# Altium schematic sheet ESPSmartPlug.SchDoc
size A
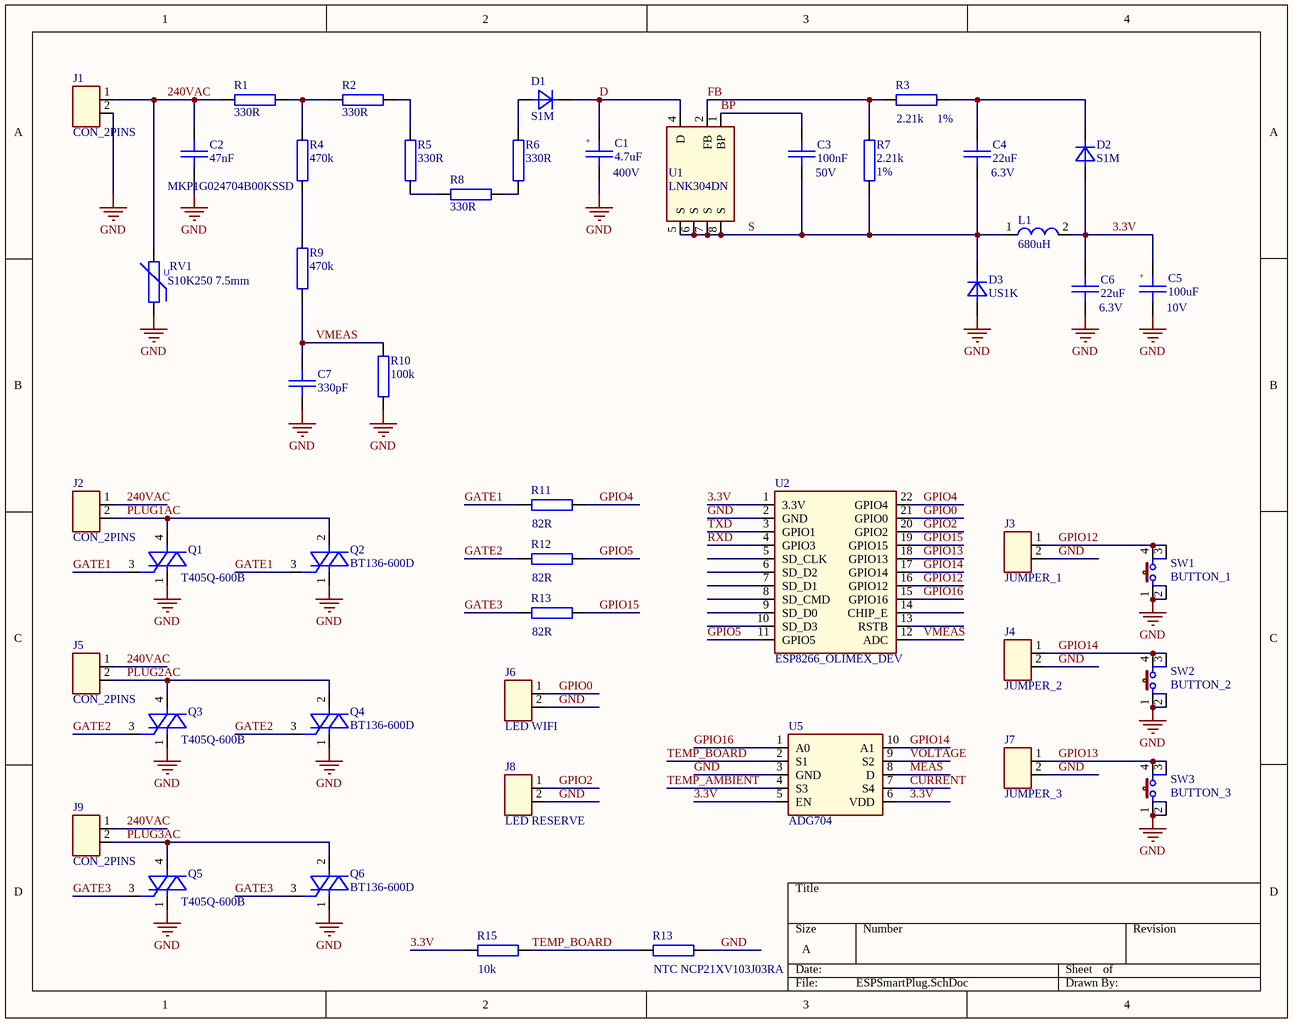
[diagram p0: ESPSmartPlug.SchDoc]

## Parts
(Parts that share a designator on the sheet are numbered #1, #2 ... from top to bottom, then left to right.)
C1  4.7uF  VOLTAGE: 400V  [SMD_CAPAE1030X1050N]
C2  47nF  MANUFACTURER_NUMBER: MKP1G024704B00KSSD  [PTH_CAPA1500-630X1850X1550]
C3  100nF  VOLTAGE: 50V  [SMD_0603_CAPC1608X95N]
C4  22uF  VOLTAGE: 6.3V  [SMD_0805_CAPC2012X95N]
C5  100uF  VOLTAGE: 10V  [SMD_CAPAE660X550N]
C6  22uF  VOLTAGE: 6.3V  [SMD_0805_CAPC2012X95N]
C7  330pF  [SMD_0603_CAPC1608X95N]
D1  S1M  [SMD_DO214AC_SMA]
D2  S1M  [SMD_DO214AC_SMA]
D3  US1K  [SMD_DO214AC_SMA]
J1  CON_2PINS  [PTH_HDRV02W11060P500_1X02]
J2  CON_2PINS  [PTH_HDRV02W11060P500_1X02]
J3  JUMPER_1  [PTH_HDRV02W64P254_1X02]
J4  JUMPER_2  [PTH_HDRV02W64P254_1X02]
J5  CON_2PINS  [PTH_HDRV02W11060P500_1X02]
J6  LED WIFI  [PTH_LED-KINGBRIGHT-L-934SGC]
J7  JUMPER_3  [PTH_HDRV02W64P254_1X02]
J8  LED RESERVE  [PTH_LED-KINGBRIGHT-L-934SGC]
J9  CON_2PINS  [PTH_HDRV02W11060P500_1X02]
L1  680uH  [SMT_INDM135130X800N]
Q1  T405Q-600B  [SMD_TO229P991X239-4N_DPAK]
Q2  BT136-600D  [PTH_TO220AB]
Q3  T405Q-600B  [SMD_TO229P991X239-4N_DPAK]
Q4  BT136-600D  [PTH_TO220AB]
Q5  T405Q-600B  [SMD_TO229P991X239-4N_DPAK]
Q6  BT136-600D  [PTH_TO220AB]
R1  330R  [SMD_1206_RESC3216X102N]
R2  330R  [SMD_1206_RESC3216X102N]
R3  2.21k  TOLERANCE: 1%  [SMD_0603_RESC1608X55N]
R4  470k  [SMD_1206_RESC3216X102N]
R5  330R  [SMD_1206_RESC3216X102N]
R6  330R  [SMD_1206_RESC3216X102N]
R7  2.21k  TOLERANCE: 1%  [SMD_0603_RESC1608X55N]
R8  330R  [SMD_1206_RESC3216X102N]
R9  470k  [SMD_1206_RESC3216X102N]
R10  100k  [SMD_1206_RESC3216X102N]
R11  82R  [SMD_0603_RESC1608X55N]
R12  82R  [SMD_0603_RESC1608X55N]
R13#1  82R  [SMD_0603_RESC1608X55N]
R13#2  NTC NCP21XV103J03RA  [SMD_0805_RESC2012X60N]
R15  10k  [SMD_0603_RESC1608X55N]
RV1  S10K250 7.5mm  [PTH_VAR_S10K275]
SW1  BUTTON_1  [PTH_SWI_TACT-64K_H1690]
SW2  BUTTON_2  [PTH_SWI_TACT-64K_H1690]
SW3  BUTTON_3  [PTH_SWI_TACT-64K_H1690]
U1  LNK304DN  [SMD_SOIC127P600X175-7N]
U2  ESP8266_OLIMEX_DEV  [PTH_DIP22_DOUBLE]
U5  ADG704  [SMD_SOP50P490X110-10N]

## Nets
GND: C1.2 C2.2 C5.2 C6.2 C7.2 D3.2(A) J1.2 J3.2 J4.2 J6.2 J7.2 J8.2 Q1.1(T1) Q2.1(T1) Q3.1(T1) Q4.1(T1) Q5.1(T1) Q6.1(T1) R10.1 R13#2.2 RV1.2 SW1.1 SW1.2 SW2.1 SW2.2 SW3.1 SW3.2 U2.2(GND) U5.3(GND)
3.3V: C5.1 C6.1 D2.2(A) L1.2 R15.1 U2.1(3.3V) U5.5(EN) U5.6(VDD)
240VAC: C2.1 J1.1 J2.1 J5.1 J9.1 R1.2 RV1.1
BP: C3.1 U1.1(BP)
CURRENT: U5.7(S4)
D: C1.1 D1.1(C) U1.4(D)
FB: R3.1 R7.1 U1.2(FB)
GATE1: Q1.3(G) Q2.3(G) R11.1
GATE2: Q3.3(G) Q4.3(G) R12.1
GATE3: Q5.3(G) Q6.3(G) R13#1.1
GPIO0: J6.1 U2.21(GPIO0)
GPIO2: J8.1 U2.20(GPIO2)
GPIO4: R11.2 U2.22(GPIO4)
GPIO5: R12.2 U2.11(GPIO5)
GPIO12: J3.1 SW1.3 SW1.4 U2.16(GPIO12)
GPIO13: J7.1 SW3.3 SW3.4 U2.18(GPIO13)
GPIO14: J4.1 SW2.3 SW2.4 U2.17(GPIO14) U5.10(A1)
GPIO15: R13#1.2 U2.19(GPIO15)
GPIO16: U2.15(GPIO16) U5.1(A0)
MEAS: U5.8(D)
PLUG1AC: J2.2 Q1.4(T2) Q2.2(T2)
PLUG2AC: J5.2 Q3.4(T2) Q4.2(T2)
PLUG3AC: J9.2 Q5.4(T2) Q6.2(T2)
RXD: U2.4(GPIO3)
S: C3.2 C4.2 D3.1(C) L1.1 R7.2 U1.5(S) U1.6(S) U1.7(S) U1.8(S)
TEMP_AMBIENT: U5.4(S3)
TEMP_BOARD: R13#2.1 R15.2 U5.2(S1)
TXD: U2.3(GPIO1)
VMEAS: C7.1 R9.1 R10.2 U2.12(ADC)
VOLTAGE: U5.9(S2)
NetC4_1: C4.1 D2.1(C) R3.2
NetD1_2: D1.2(A) R6.1
NetR1_1: R1.1 R2.2 R4.2
NetR2_1: R2.1 R5.2
NetR4_1: R4.1 R9.2
NetR5_1: R5.1 R8.1
NetR6_2: R6.2 R8.2

Not connected (* = marked no-connect by the designer): U2 5(SD_CLK) 6(SD_D2) 7(SD_D1) 8(SD_CMD) 9(SD_D0) 10(SD_D3) 13(RSTB) 14(CHIP_E)

## Notes on the sheet
- (in symbol C_POL) +
- (in symbol VARISTOR) U

## Library data of the parts
C1 C5 = C_POL
C2 = C: 47nF 310V; NOTE: <NOTE>
C3 C4 C6 C7 = C: NOTE: <NOTE>
D1-D3 = D: NOTE: <NOTE>
J1-J9 = CON_2PINS: NOTE: <NOTE>
L1 = L
Q1 Q3 Q5 = THYR_T11G3T24: NOTE: <NOTE>
Q2 Q4 Q6 = THYR_T11T22G3: NOTE: <NOTE>
R1-R10 = R: NOTE: <NOTE>; R_BDS: R
R11 R12 R13#1 R13#2 R15 = R: NOTE: <NOTE>; TOLERANCE: 5%; R_BDS: R
RV1 = VARISTOR: NOTE: <NOTE>; R_BDS: R
SW2 SW3 = BUTTON_1
U1 = IC_LNK302-306D_SO-8C: NOTE: <NOTE>
U2 = MOD_ESP8266_OLIMEX
U5 = IC_ADG704: Analog Multiplexor 4-Channel; NOTE: <NOTE>